# EAGLE design Macropad (EAGLE 9.6.2)
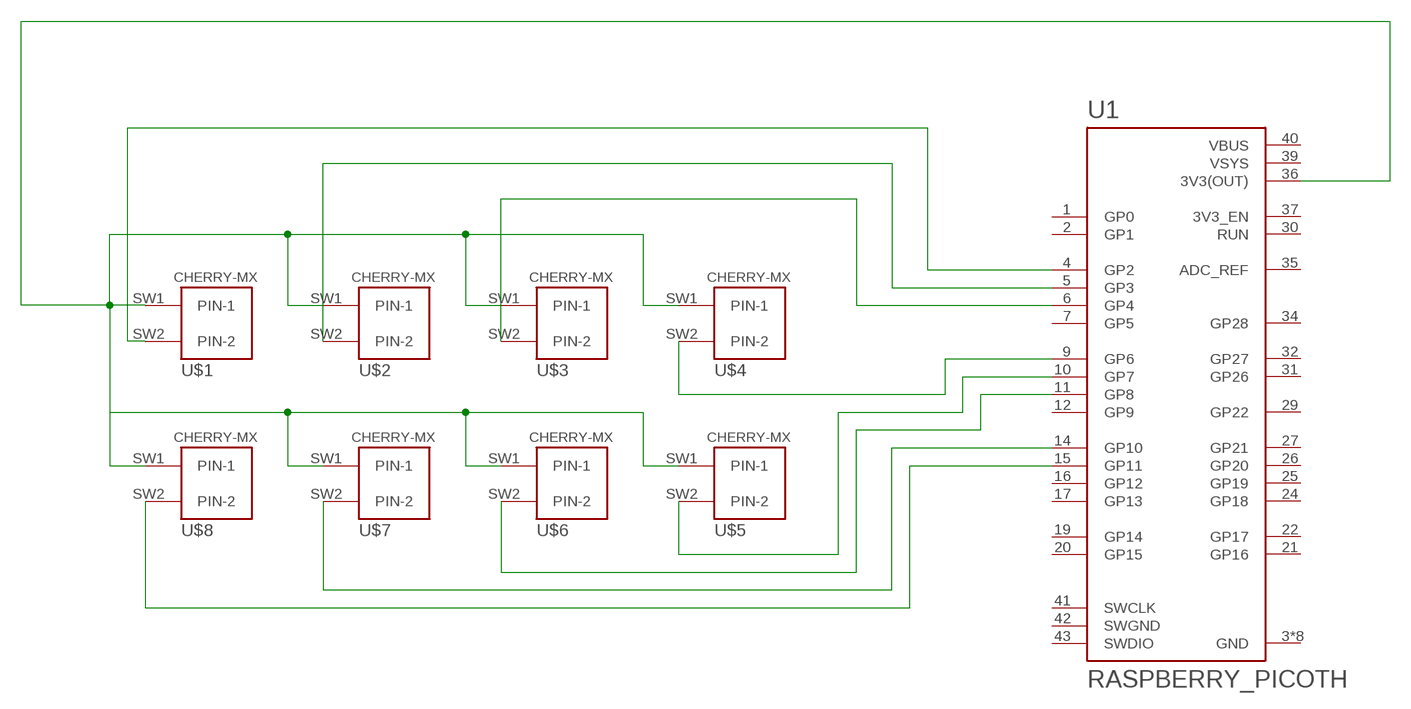
[diagram p0: schematic, sheet 1]

## Parts
U1  RASPBERRY_PICOTH  [PICO-PKG-TH]
U$1  CHERRY-MX  [CHERRY-MX]
U$2  CHERRY-MX  [CHERRY-MX]
U$3  CHERRY-MX  [CHERRY-MX]
U$4  CHERRY-MX  [CHERRY-MX]
U$5  CHERRY-MX  [CHERRY-MX]
U$6  CHERRY-MX  [CHERRY-MX]
U$7  CHERRY-MX  [CHERRY-MX]
U$8  CHERRY-MX  [CHERRY-MX]

## Nets
N$1: U1.9(GP6) U$4.SW2(PIN-2)
N$2: U1.36(3V3(OUT)) U$1.SW1(PIN-1) U$2.SW1(PIN-1) U$3.SW1(PIN-1) U$4.SW1(PIN-1) U$5.SW1(PIN-1) U$6.SW1(PIN-1) U$7.SW1(PIN-1) U$8.SW1(PIN-1)
N$3: U1.6(GP4) U$3.SW2(PIN-2)
N$4: U1.5(GP3) U$2.SW2(PIN-2)
N$5: U1.4(GP2) U$1.SW2(PIN-2)
N$6: U1.10(GP7) U$5.SW2(PIN-2)
N$7: U1.11(GP8) U$6.SW2(PIN-2)
N$8: U1.14(GP10) U$7.SW2(PIN-2)
N$9: U1.15(GP11) U$8.SW2(PIN-2)
Unconnected: U1.1(GP0) U1.2(GP1) U1.7(GP5) U1.12(GP9) U1.16(GP12) U1.17(GP13) U1.19(GP14) U1.20(GP15) U1.21(GP16) U1.22(GP17) U1.24(GP18) U1.25(GP19) U1.26(GP20) U1.27(GP21) U1.29(GP22) U1.30(RUN) U1.31(GP26) U1.32(GP27) U1.34(GP28) U1.35(ADC_REF) U1.37(3V3_EN) U1.41(SWCLK) U1.43(SWDIO)

## Power pins joined to a net without a drawn wire
GND: U1.3(GND) U1.8(GND) U1.13(GND) U1.18(GND) U1.23(GND) U1.28(GND) U1.33(GND) U1.38(GND)
SWGND: U1.42(SWGND)
VBUS: U1.40(VBUS)
VSYS: U1.39(VSYS)

## Library data of the parts
U1 = RpiPico:RASPBERRY_PICO: Raspberry Pi Pico
U$1-U$8 = cherrymx:CHERRY-MX: Cherry MX series keyswitch

## Board
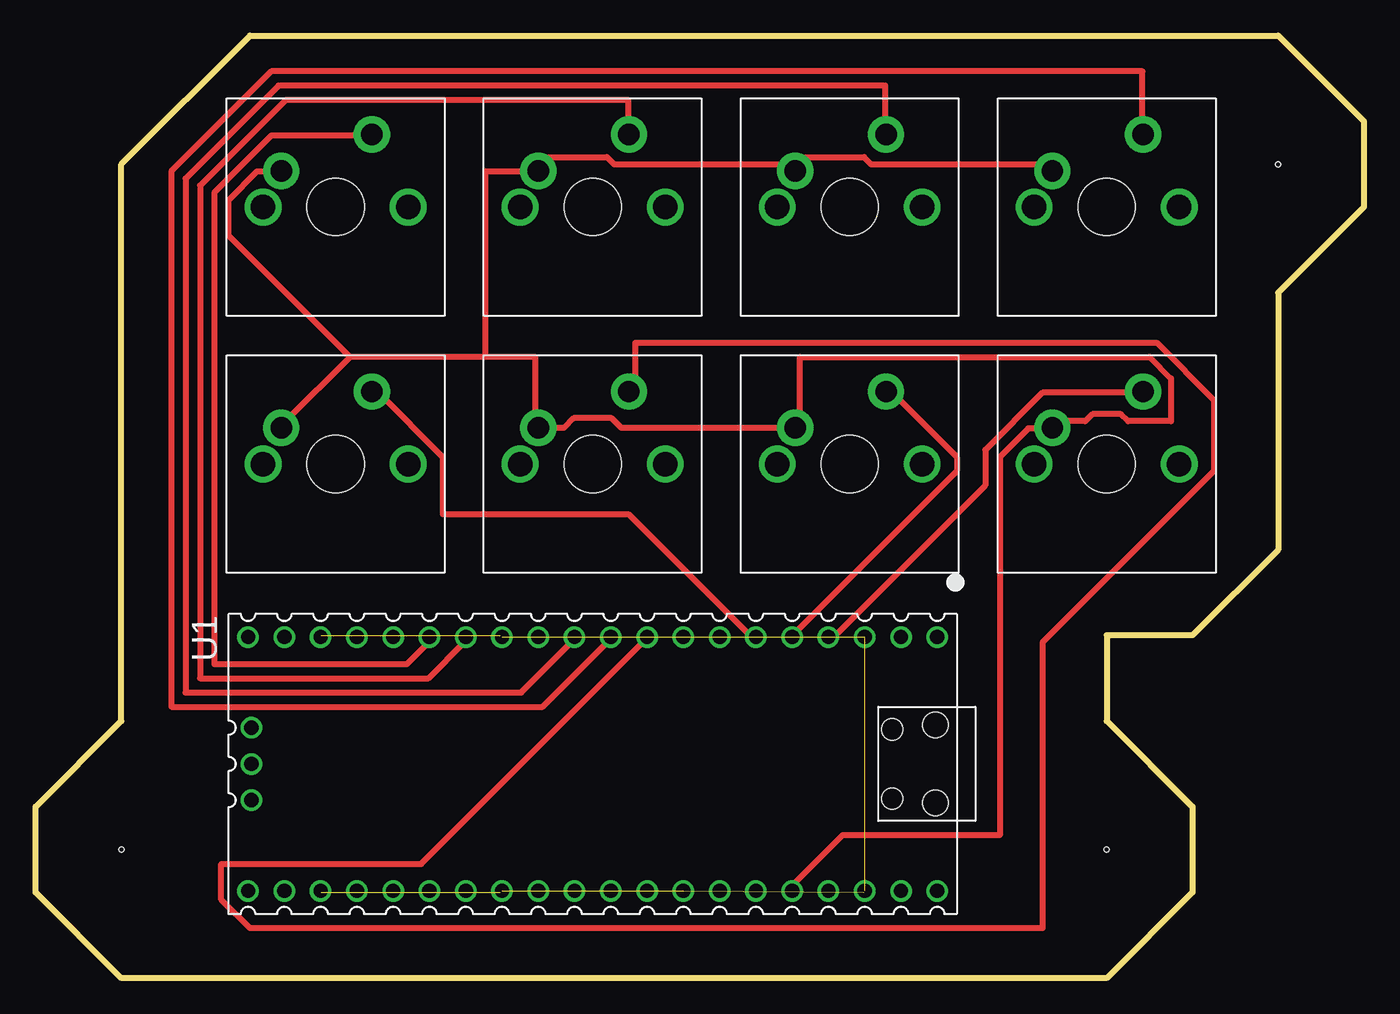
[diagram p1: board, top side]

Size 93 x 66 mm. Coordinates in mm from the lower left corner, seen from the top.
Outline: 15,66 87,66 93,60 93,54 87,48 87,30 81,24 75,24 75,18 81,12 81,6 75,0 6,0 0,6 0,12 6,18 6,57 15,66
Copper layers (1*16): Top 0.035mm / dielectric 1.5mm / Bottom 0.035mm
Design rules "default *": minimum track width 16mil, minimum drill 0.35mm, track to track 18mil, track to pad 18mil, pad to pad 6mil, via to via 6mil, smd to smd 6mil, copper to edge 40mil, drill to drill 6mil, minimum pad ring 10mil, minimum via ring 8mil, stop-mask expansion 4mil, vias tented up to drill 0mil, thermal gap 10mil
Holes 0.35 mm at 6,9 87,57 75,9

### Footprints (pad centres in the part's own frame; a part is rotated, then mirrored left to right if it is on the bottom)
PICO-PKG-TH = drill 1: 1 -8.89,24.13; 2 -8.89,21.59; 3 -8.89,19.05; 4 -8.89,16.51; 5 -8.89,13.97; 6 -8.89,11.43; 7 -8.89,8.89; 8 -8.89,6.35; 9 -8.89,3.81; 10 -8.89,1.27; 11 -8.89,-1.27; 12 -8.89,-3.81; 13 -8.89,-6.35; 14 -8.89,-8.89; 15 -8.89,-11.43; 16 -8.89,-13.97; 17 -8.89,-16.51; 18 -8.89,-19.05; 19 -8.89,-21.59; 20 -8.89,-24.13; 21 8.89,-24.13; 22 8.89,-21.59; 23 8.89,-19.05; 24 8.89,-16.51; 25 8.89,-13.97; 26 8.89,-11.43; 27 8.89,-8.89; 28 8.89,-6.35; 29 8.89,-3.81; 30 8.89,-1.27; 31 8.89,1.27; 32 8.89,3.81; 33 8.89,6.35; 34 8.89,8.89; 35 8.89,11.43; 36 8.89,13.97; 37 8.89,16.51; 38 8.89,19.05; 39 8.89,21.59; 40 8.89,24.13; 41 -2.54,-23.9; 42 0,-23.9; 43 2.54,-23.9 | hole 1.8: -2.725,24; 2.725,24 | hole 1.5: -2.425,20.97; 2.425,20.97
CHERRY-MX = drill 1.714 pad 1.93: P$3 -5.08,0; P$4 5.08,0 | drill 1.5 pad 2.54: SW1 -3.81,2.54; SW2 2.54,5.08 | hole 4: 0,0

### Placement (x,y rotation side)
U1  39,15 270 top
U$1  75,36 0 top
U$2  57,36 0 top
U$3  21,36 0 top
U$4  39,36 0 top
U$5  75,54 0 top
U$6  57,54 0 top
U$7  39,54 0 top
U$8  21,54 0 top

### Tracks (layer width: path | path; a pad name or v marks a point on that pad's centre or on a via)
GND  (7 unrouted)
  Top 0.406: 20,24 U1.18 | 32.5,24 U1.13 | 20,6 U1.23 | 32.5,6 U1.28 | 58,6 U1.38
N$1
  Top 0.406: U1.9 42.5,23.5 27,8 13,8 13,5.5 15,3.5 70.5,3.5 70.5,23.5 82.5,35.5 82.5,40.5 78.5,44.5 42,44.5 42,41.5 U$4.SW2
N$2
  Top 0.406: U1.36 53,6.5 56.5,10 67.5,10 67.5,36.5 69.5,38.5 71,38.5 U$1.SW1 71.5,39 73.5,39 74,39.5 76,39.5 76.5,39 79.5,39 79.5,42 78,43.5 53.5,43.5 53.5,39 U$2.SW1 41.01,38.54 40.33,39.22 37.67,39.22 36.99,38.54 U$4.SW1 | 22,43.5 17.5,39 U$3.SW1 | 31.5,43.5 35,43.5 35,39.5 | 31.5,43.5 22,43.5 | 35,39.5 35,39 U$4.SW1 | 35,39.5 U$4.SW1 | 22,43.5 13.5,52 13.5,54.5 15.5,56.5 17,56.5 U$8.SW1 | 31.5,43.5 31.5,56.5 35,56.5 U$7.SW1 35.5,57 35.5,57.5 40,57.5 40.5,57 53,57 U$6.SW1 53.5,57 53.5,57.5 58,57.5 58.5,57 71,57 U$5.SW1
N$3
  Top 0.406: U1.6 50,24 41.5,32.5 28.5,32.5 28.5,36.5 24,41 U$3.SW2
N$4
  Top 0.406: U1.5 53,24 64.5,35.5 64.5,36.5 60,41 U$2.SW2
N$5
  Top 0.406: U1.4 56,24 66.5,34.5 66.5,37 70.5,41 77.5,41 U$1.SW2
N$6
  Top 0.406: U1.10 40,23.5 35.5,19 9.5,19 9.5,56.5 16.5,63.5 77.5,63.5 77.5,59.5 U$5.SW2
N$7
  Top 0.406: U1.11 37.5,23.5 34,20 10.5,20 10.5,56 17,62.5 59.5,62.5 59.5,59.5 U$6.SW2
N$8
  Top 0.406: U1.14 30,23.5 27.5,21 11.5,21 11.5,55.5 17.5,61.5 41.5,61.5 41.5,59.5 U$7.SW2
N$9
  Top 0.406: U1.15 27.5,23.5 26,22 12.5,22 12.5,55 16.5,59 23.5,59 U$8.SW2